# EAGLE design gprs_i2c (EAGLE 7.3.0)
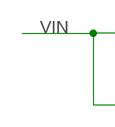
[diagram p0: schematic, sheet 1, part 1 of 2]
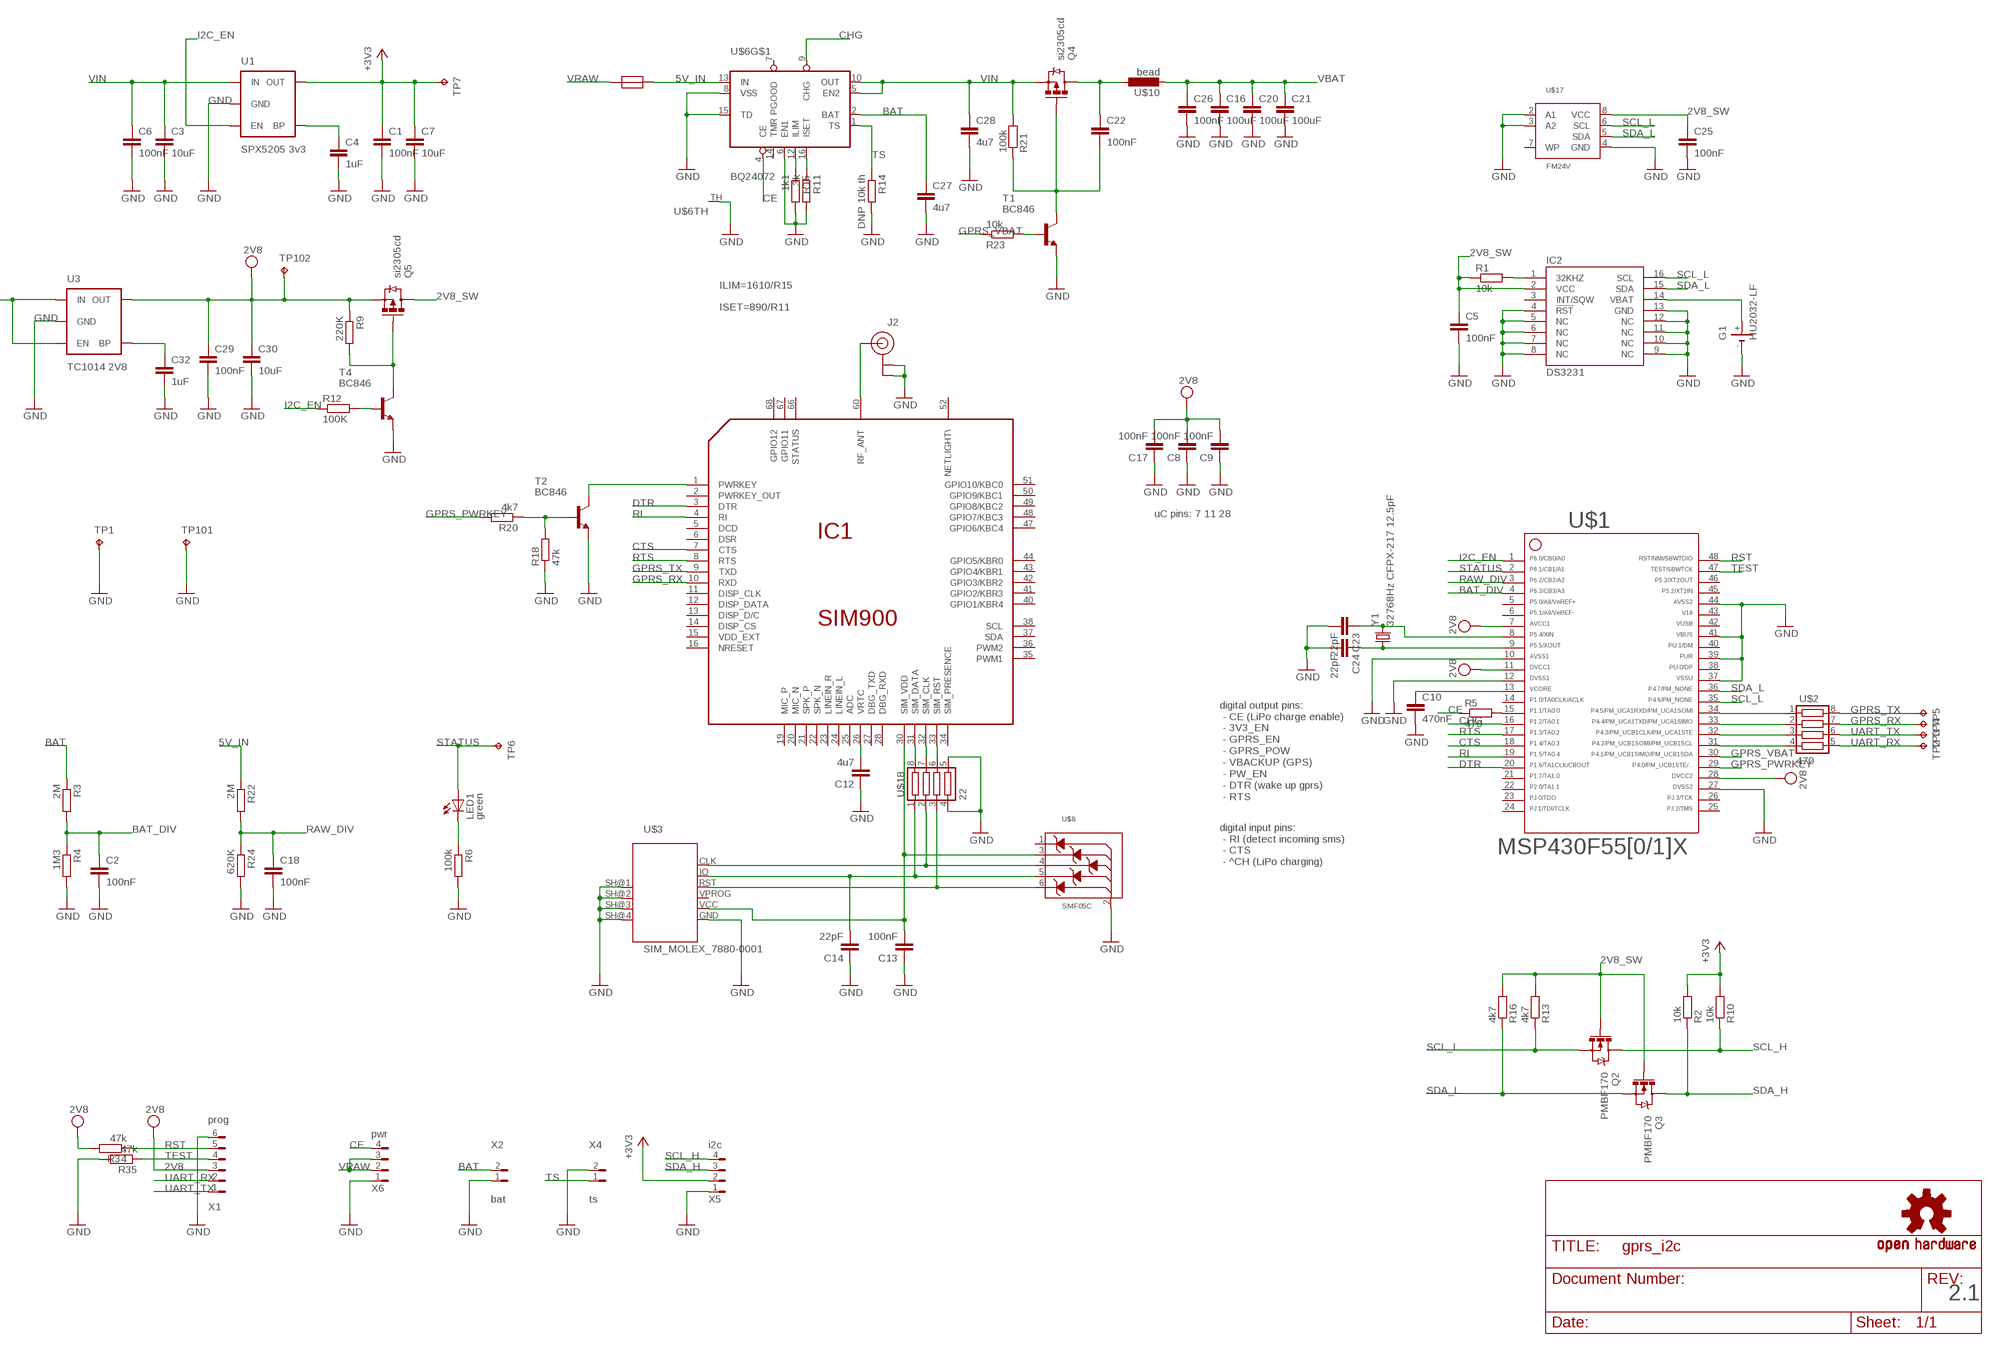
[diagram p1: schematic, sheet 1, part 2 of 2]

## Parts
C1  100nF  C-EUC0805  [C0805]
C2  100nF  C-EUC0805  [C0805]
C3  10uF  C-EUC0805  [C0805]
C4  1uF  C-EUC0805  [C0805]
C5  100nF  C-EUC0805  [C0805]
C6  100nF  C-EUC0805  [C0805]
C7  10uF  C-EUC1206  [C1206]
C8  100nF  C-EUC0805  [C0805]
C9  100nF  C-EUC0805  [C0805]
C10  470nF  C-EUC0805  [C0805]
C12  4u7  C-EUC0805  [C0805]
C13  100nF  C-EUC0805  [C0805]
C14  22pF  C-EUC0805  [C0805]
C16  100uF  C-EUC1206  [C1206]
C17  100nF  C-EUC0805  [C0805]
C18  100nF  C-EUC0805  [C0805]
C20  100uF  C-EUC1206  [C1206]
C21  100uF  C-EUC1206  [C1206]
C22  100nF  C-EUC0805  [C0805]
C23  22pF  C-EUC0805  [C0805]
C24  22pF  C-EUC0805  [C0805]
C25  100nF  C-EUC0805  [C0805]
C26  100nF  C-EUC0805  [C0805]
C27  4u7  C-EUC1206  [C1206]
C28  4u7  C-EUC1206  [C1206]
C29  100nF  C-EUC0805  [C0805]
C30  10uF  C-EUC1206  [C1206]
C32  1uF  C-EUC0805  [C0805]
G1  HU2032-LF  [HU2032-LF]
IC1  SIM900  [SIM900]
IC2  DS3231  [SO-16]
J2  U.FL  [U.FL]
LED1  green  LEDCHIPLED_0805  [CHIPLED_0805]
Q2  PMBF170  MOSFET-NCHANNEL_SOT23-3  [SOT23-3]
Q3  PMBF170  MOSFET-NCHANNEL_SOT23-3  [SOT23-3]
Q4  si2305cd  MOSFET-PCHANNELSMD_POWER  [SOT23-3_POWER@1]
Q5  si2305cd  MOSFET-PCHANNELSMD_POWER  [SOT23-3_POWER@1]
R1  10k  R-EU_R0805W  [R0805W]
R2  10k  R-EU_R0805W  [R0805W]
R3  2M  R-EU_R0805W  [R0805W]
R4  1M3  R-EU_R0805W  [R0805W]
R5  470  R-EU_R0805W  [R0805W]
R6  100k  R-EU_R0805W  [R0805W]
R9  220K  R-EU_R0805W  [R0805W]
R10  10k  R-EU_R0805W  [R0805W]
R11  3k  R-EU_R0805W  [R0805W]
R12  100K  R-EU_R0805W  [R0805W]
R13  4k7  R-EU_R0805W  [R0805W]
R14  DNP 10k th  R-EU_R0805W  [R0805W]
R15  1k1  R-EU_R0805W  [R0805W]
R16  4k7  R-EU_R0805W  [R0805W]
R18  47k  R-EU_R0805W  [R0805W]
R20  4k7  R-EU_R0805W  [R0805W]
R21  100k  R-EU_R0805W  [R0805W]
R22  2M  R-EU_R0805W  [R0805W]
R23  10k  R-EU_R0805W  [R0805W]
R24  620K  R-EU_R0805W  [R0805W]
R34  47k  R-EU_R0805W  [R0805W]
R35  47k  R-EU_R0805W  [R0805W]
T1  BC846  [SOT23]
T2  BC846  [SOT23]
T4  BC846  [SOT23]
TP1  TPTP12R  [TP12R]
TP2  TPTP12R  [TP12R]
TP3  TPTP12R  [TP12R]
TP4  TPTP12R  [TP12R]
TP5  TPTP12R  [TP12R]
TP6  TPTP12R  [TP12R]
TP7  TPTP12R  [TP12R]
TP101  TPTP12R  [TP12R]
TP102  TPTP12R  [TP12R]
U1  SPX5205 3v3  V_REG_LDOSMD  [SOT23-5]
U3  TC1014 2V8  V_REG_LDOSMD  [SOT23-5]
U$1  MSP430F5510  F55[0/1]X---PT48  [PT48]
U$2  470  RES_ARR  [YC164]
U$3  SIM_MOLEX_7880-0001  [MOLEX_7880-0001]
U$5  RESETTABLE_0805  [0805W]
U$6  BQ24072  [S-PVQFN-N16]
U$7  OSHW-LOGOM  [OSHW-LOGO-M]
U$8  SMF05C  [SC-88]
U$10  bead  INDUCTOR  [L0805W]
U$17  FM24V  [SO-08]
U$18  22  RES_ARR  [YC164]
X1  prog  MOLEX_6VERTICAL  [0530470610]
X2  bat  MOLEX_2HORIZONTAL  [0530480210]
X4  ts  MOLEX_2HORIZONTAL  [0530480210]
X5  i2c  MOLEX_4HORIZONTAL  [0530480401]
X6  pwr  MOLEX_4HORIZONTAL  [0530480401]
Y1  32768Hz CFPX-217 12.5pF  CRYSTAL3.2X1.5  [CRYSTAL-SMD-3.2X1.5]

## Nets
2V8: C8.2 C9.2 C17.2 C29.1 C30.1 Q5.2(S) R9.1 R34.2 TP102.TP U3.5(OUT) U$1.7 U$1.11 U$1.28 X1.3
2V8_SW: C5.1 C25.1 IC2.2(VCC) Q2.1(G) Q3.1(G) Q5.3(D) R1.1 R13.2 R16.2 U$17.8(VCC)
5V_IN: R22.1 U$5.2 U$6.13(IN)
+3V3: C1.1 C7.1 R2.2 R10.2 TP7.TP U1.5(OUT) X5.2
BAT: C27.1 R3.1 U$6.2(BAT) X2.2
BAT_DIV: C2.1 R3.2 R4.1 U$1.4
CE: R5.1 U$6.4(CE) X6.4
CHG: U$1.16 U$6.9(CHG)
CTS: IC1.7(CTS) U$1.18
DTR: IC1.3(DTR) U$1.20
GND: C1.2 C2.2 C3.2 C4.2 C5.2 C6.2 C7.2 C8.1 C9.1 C10.2 C12.1 C13.1 C14.1 C16.2 C17.1 C18.2 C20.2 C21.2 C23.2 C24.2 C25.2 C26.2 C27.2 C28.2 C29.2 C30.2 C32.2 G1.- IC2.4(!RST) IC2.5(NC) IC2.6(NC) IC2.7(NC) IC2.8(NC) IC2.9(NC) IC2.10(NC) IC2.11(NC) IC2.12(NC) IC2.13(GND) J2.P$1(GND) J2.P$2(GND) R4.2 R6.2 R11.2 R14.2 R15.2 R18.1 R24.2 R35.2 T1.2(E) T2.2(E) T4.2(E) TP1.TP TP101.TP U1.2(GND) U3.2(GND) U$1.10 U$1.12 U$1.27 U$1.37 U$1.39 U$1.41 U$1.44 U$3.GND U$3.SH@1(SH) U$3.SH@2(SH) U$3.SH@3(SH) U$3.SH@4(SH) U$6.6(EN1) U$6.8(VSS) U$6.15(TD) U$6.TH(TH:TH) U$8.2(ANODE) U$17.2(A1) U$17.3(A2) U$17.4(GND) U$18.4 U$18.5 X1.6 X2.1 X4.2 X5.1 X6.1
GPRS_PWRKEY: R20.2 U$1.29
GPRS_RX: IC1.10(RXD) TP4.TP U$2.7
GPRS_TX: IC1.9(TXD) TP5.TP U$2.8
GPRS_VBAT: R23.1 U$1.30
I2C_EN: R12.1 U1.3(EN) U$1.1
N$1: U$1.32 U$2.3
N$2: C4.1 U1.4(BP)
N$3: U$1.31 U$2.4
N$4: U$1.33 U$2.2
N$5: G1.+ IC2.14(VBAT)
N$6: C10.1 U$1.13
N$7: R23.2 T1.1(B)
N$8: LED1.C R6.1
N$9: IC2.1(32KHZ) R1.2
N$10: U$1.34 U$2.1
N$11: R5.2 U$1.15
N$14: Q5.1(G) R9.2 T4.3(C)
N$15: R12.2 T4.1(B)
N$17: IC1.31(SIM_DATA) U$18.8
N$18: IC1.32(SIM_CLK) U$18.7
N$19: IC1.33(SIM_RST) U$18.6
N$25: C24.1 U$1.9 Y1.P$1
N$26: C23.1 U$1.8 Y1.P$2
N$27: R11.1 U$6.16(ISET)
N$33: R15.1 U$6.12(ILIM)
N$45: R18.2 R20.1 T2.1(B)
N$46: IC1.60(RF_ANT) J2.P$3(SIGNAL)
N$48: C22.2 Q4.1(G) R21.1 T1.3(C)
N$49: C22.1 Q4.3(D) U$10.1
N$50: C32.1 U3.4(BP)
PWRKEY: IC1.1(PWRKEY) T2.3(C)
RAW_DIV: C18.1 R22.2 R24.1 U$1.3
RI: IC1.4(RI) U$1.19
RST: R34.1 U$1.48 X1.5
RTS: IC1.8(RTS) U$1.17
SCL_H: Q2.3(D) R10.1 X5.4
SCL_L: IC2.16(SCL) Q2.2(S) R13.1 U$1.35 U$17.6(SCL)
SDA_H: Q3.3(D) R2.1 X5.3
SDA_L: IC2.15(SDA) Q3.2(S) R16.1 U$1.36 U$17.5(SDA)
SIM_VCC: C13.2 IC1.30(SIM_VDD) U$3.VCC U$8.3(CATODE2)
SIMLOCK_CLK: U$3.CLK U$8.4(CATODE3) U$18.2
SIMLOCK_IO: C14.2 U$3.IO U$8.5(CATODE4) U$18.1
SIMLOCK_RST: U$3.RST U$8.6(CATODE5) U$18.3
STATUS: LED1.A TP6.TP U$1.2
TEST: R35.1 U$1.47 X1.4
TS: R14.1 U$6.1(TS) X4.1
UART_RX: TP2.TP U$2.5 X1.2
UART_TX: TP3.TP U$2.6 X1.1
VBAT: C16.1 C20.1 C21.1 C26.1 U$10.2
VIN: C3.1 C6.1 C28.1 Q4.2(S) R21.2 U1.1(IN) U3.1(IN) U3.3(EN) U$6.5(EN2) U$6.10(OUT)
VRAW: U$5.1 X6.2 X6.3
VRTC: C12.2 IC1.26(VRTC)
Unconnected: G1.+@1(+) IC1.2(PWRKEY_OUT) IC1.5(DCD) IC1.6(DSR) IC1.11(DISP_CLK) IC1.12(DISP_DATA) IC1.13(DISP_D/C) IC1.14(DISP_CS) IC1.15(VDD_EXT) IC1.16(NRESET) IC1.19(MIC_P) IC1.20(MIC_N) IC1.21(SPK_P) IC1.22(SPK_N) IC1.23(LINEIN_R) IC1.24(LINEIN_L) IC1.25(ADC) IC1.27(DBG_TXD) IC1.28(DBG_RXD) IC1.34(SIM_PRESENCE) IC1.35(PWM1) IC1.36(PWM2) IC1.37(SDA) IC1.38(SCL) IC1.40(GPIO1/KBR4) IC1.41(GPIO2/KBR3) IC1.42(GPIO3/KBR2) IC1.43(GPIO4/KBR1) IC1.44(GPIO5/KBR0) IC1.47(GPIO6/KBC4) IC1.48(GPIO7/KBC3) IC1.49(GPIO8/KBC2) IC1.50(GPIO9/KBC1) IC1.51(GPIO10/KBC0) IC1.52(NETLIGHT\) IC1.66(STATUS) IC1.67(GPIO11) IC1.68(GPIO12) IC2.3(INT/SQW) U$1.5 U$1.6 U$1.14 U$1.21 U$1.22 U$1.23 U$1.24 U$1.25 U$1.26 U$1.38 U$1.40 U$1.45 U$3.VPROG U$6.7(PGOOD) U$6.14(TMR) U$8.1(CATODE1) U$17.7(WP)

## Notes on the sheet
- ILIM=1610/R15
- ISET=890/R11
- uC pins: 7 11 28
- digital output pins: 
   - CE (LiPo charge enable)
   - 3V3_EN
   - GPRS_EN
   - GPRS_POW
   - VBACKUP (GPS)
   - PW_EN
   - DTR (wake up gprs)
   - RTS
- digital input pins:
   - RI (detect incoming sms)
   - CTS
   - ^CH (LiPo charging)
- 2.1

## Power pins joined to a net without a drawn wire
42: U$1.42
43: U$1.43
46: U$1.46
GND: IC1.17(GND) IC1.18(GND) IC1.29(GND) IC1.39(GND) IC1.45(GND) IC1.46(GND) IC1.53(GND) IC1.54(GND) IC1.58(GND) IC1.59(GND) IC1.61(GND) IC1.62(GND) IC1.63(GND) IC1.64(GND) IC1.65(GND)
VBAT: IC1.55(VBAT) IC1.56(VBAT) IC1.57(VBAT)

## Library data of the parts
C1-C10 C12-C14 C16-C18 C20-C30 C32 = rcl:C-EU: CAPACITOR, European symbol
G1 = Simplex-Battery:HU2032-LF: Renata HU2032 Li battery holder
IC1 = Simplex-ICs:SIM900: SIM900
IC2 = Simplex-ICs:DS3231: DS3231 RTC
J2 = SparkFun-Connectors:U.FL: SMD antenna connector- WRL-09144
LED1 = led:LED: LED OSRAM: - CHIPLED LG R971, LG N971, LY N971, LG Q971, LY Q971, LO R971, LY R971 LH N974, LH R974 LS Q976, LO Q976, LY Q976 LO Q996 - Hyper CHIPLED LW Q18S LB Q993, LB Q99A, LB R99A - SideLED LS A670, LO A670, LY A670, LG A670, LP A670 LB A673, LV A673, LT A673, LW A673 LH A674 LY A675 LS A676, LA A676, LO A676, LY A676, LW A676 LS A679, LY A679, LG A679 - Hyper Micro SIDELED® LS Y876, LA Y876, LO Y876, LY Y876 LT Y87S - SmartLED LW L88C, LW L88S LB L89C, LB L89S, LG L890 LS L89K, LO L89K, LY L89K LS L896, LA L896, LO L896, LY L896 - TOPLED LS T670, LO T670, LY T670, LG T670, LP T670 LSG T670, LSP T670, LSY T670, LOP T670, LYG T670 LG T671, LOG T671, LSG T671 LB T673, LV T673, LT T673, LW T673 LH T674 LS T676, LA T676, LO T676, LY T676, LB T676, LH T676, LSB T676, LW T676 LB T67C, LV T67C, LT T67C, LS T67K, LO T67K, LY T67K, LW E67C LS E67B, LA E67B, LO E67B, LY E67B, LB E67C, LV E67C, LT E67C LW T67C LS T679, LY T679, LG T679 LS T770, LO T770, LY T770, LG T770, LP T770 LB T773, LV T773, LT T773, LW T773 LH T774 LS E675, LA E675, LY E675, LS T675 LS T776, LA T776, LO T776, LY T776, LB T776 LHGB T686 LT T68C, LB T68C - Hyper Mini TOPLED® LB M676 - Mini TOPLED Santana® LG M470 LS M47K, LO M47K, LY M47K Source: http://www.osram.convergy.de LUXEON: - LUMILED® LXK2-PW12-R00, LXK2-PW12-S00, LXK2-PW14-U00, LXK2-PW14-V00 LXK2-PM12-R00, LXK2-PM12-S00, LXK2-PM14-U00 LXK2-PE12-Q00, LXK2-PE12-R00, LXK2-PE12-S00, LXK2-PE14-T00, LXK2-PE14-U00 LXK2-PB12-K00, LXK2-PB12-L00, LXK2-PB12-M00, LXK2-PB14-N00, LXK2-PB14-P00, LXK2-PB14-Q00 LXK2-PR12-L00, LXK2-PR12-M00, LXK2-PR14-Q00, LXK2-PR14-R00 LXK2-PD12-Q00, LXK2-PD12-R00, LXK2-PD12-S00 LXK2-PH12-R00, LXK2-PH12-S00 LXK2-PL12-P00, LXK2-PL12-Q00, LXK2-PL12-R00 Source: www.luxeon.com KINGBRIGHT: KA-3528ASYC Source: www.kingbright.com
Q2 Q3 = Simplex-DiscreteSemi:MOSFET-NCHANNEL: Generic N-channel mosfet
Q4 Q5 = Simplex-DiscreteSemi:MOSFET-PCHANNEL: Generic PMOSFET
R1-R6 R9-R16 R18 R20-R24 R34 R35 = rcl:R-EU_: RESISTOR, European symbol
T1 T2 T4 = transistor:BC846: NPN TRANSISTOR
TP1-TP7 TP101 TP102 = testpad:TP: Test pad
U1 U3 = SparkFun:V_REG_LDO: Voltage Regulator LDO Standard 150mA LDO voltage regulator in SOT-23 layout. Micrel part MIC5205. BP (by-pass) pin is used to lower output noise with 470pF cap.
U$1 = TI_MSP430_v16:F55[0/1]X---PT48: ***F55[0/1/2]X*** PT48 Rev. 1.0 06/2010 "http://www.ti.com/lit/gpn/msp430f5509" Only for FF5504, F5508,F5509,F5510
U$2 U$18 = Simplex-rlc:RES_ARR: resistor chip array yageo YC164 series (8pin/4R)
U$3 = Simplex-Connectors:SIM: SIM card holders without lock detection
U$5 = Simplex-Fuses:RESETTABLE: resettable fuse
U$6 = Simplex-ICs:BQ24072: TI BQ24072 - Li battery charger and power path management ic
U$7 = SparkFun:OSHW-LOGO: Open Source Hardware Logo This logo indicates the piece of hardware it is found on incorporates a OSHW license and/or adheres to the definition of open source hardware found here: http://freedomdefined.org/OSHW
U$8 = Simplex-DiscreteSemi:SMF05C: ON Semiconductor SMF05C 5-line transient voltage suppressor array
U$10 = Simplex-rlc:INDUCTOR: smd inductors
U$17 = Simplex-ICs:FM24V: CYPRESS FM24Vxx serial f-ram
X1 = Simplex-Connectors:MOLEX_6: Molex 6 pin connectors 1.25mm PicoBlade
X2 X4 = Simplex-Connectors:MOLEX_2: Molex 2 pin connectors 1.25mm PicoBlade
X5 X6 = Simplex-Connectors:MOLEX_4: Molex 4 pin connectors 1.25mm PicoBlade
Y1 = Simplex-FreqCtrl:CRYSTAL: smd crystals

## Net classes
1 vcc: width 0.203 mm

## Board
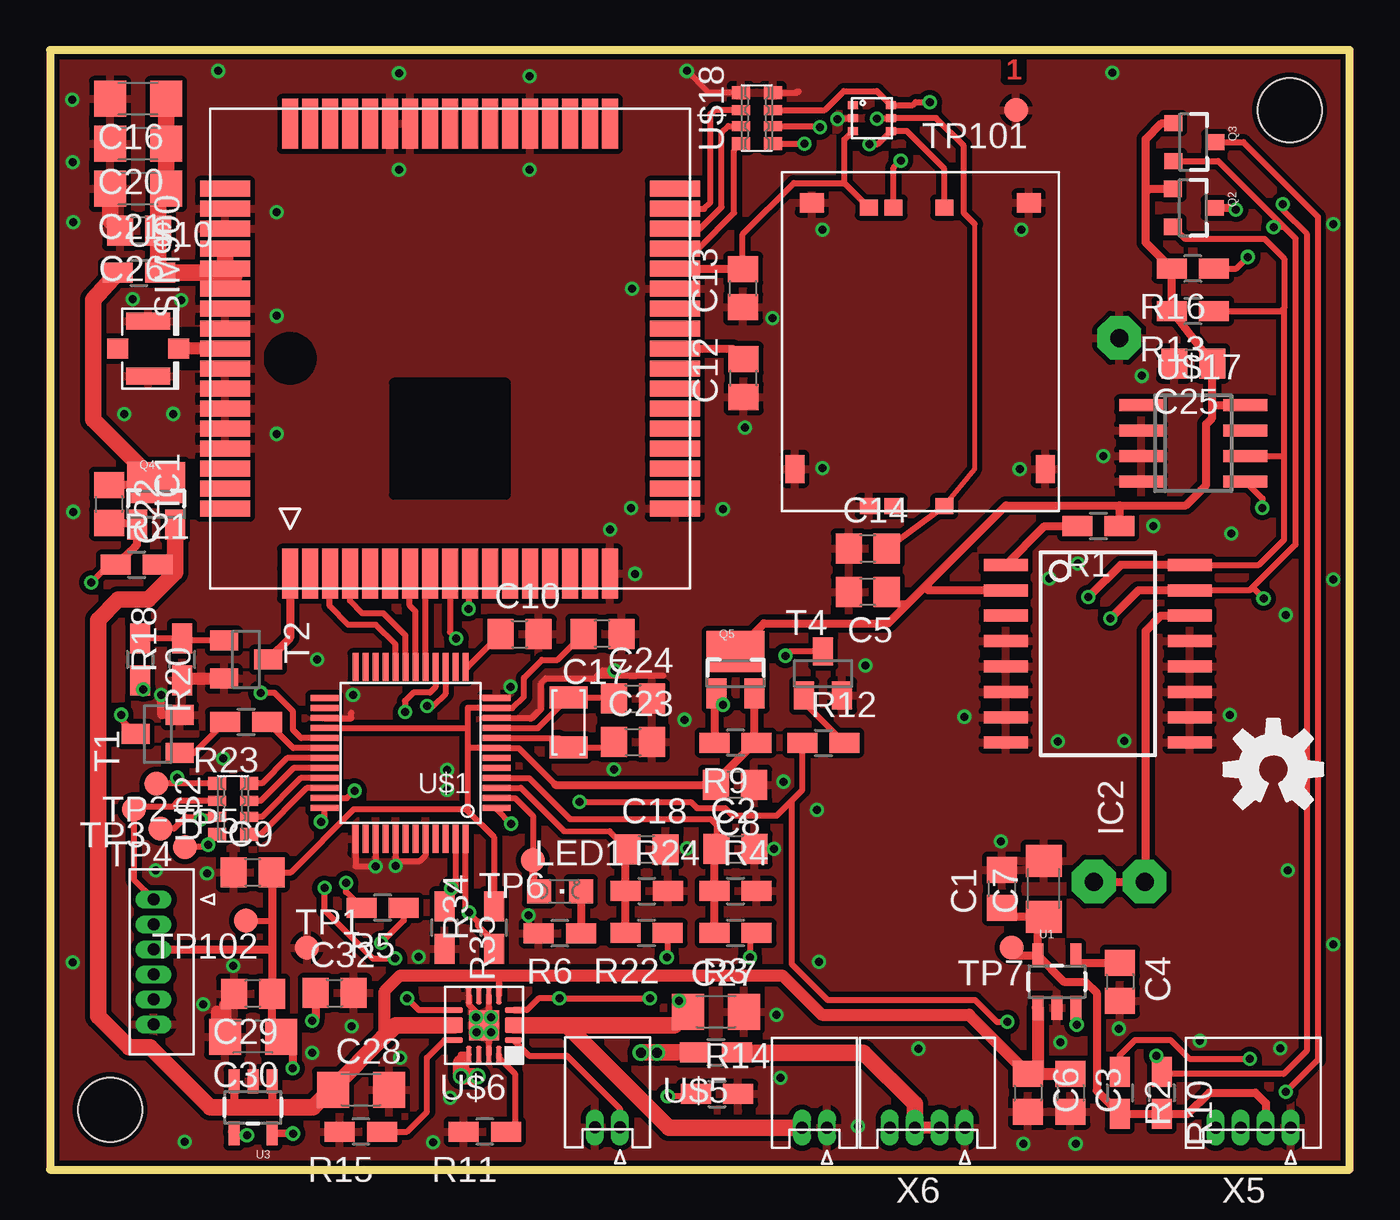
[diagram p2: board, top side]
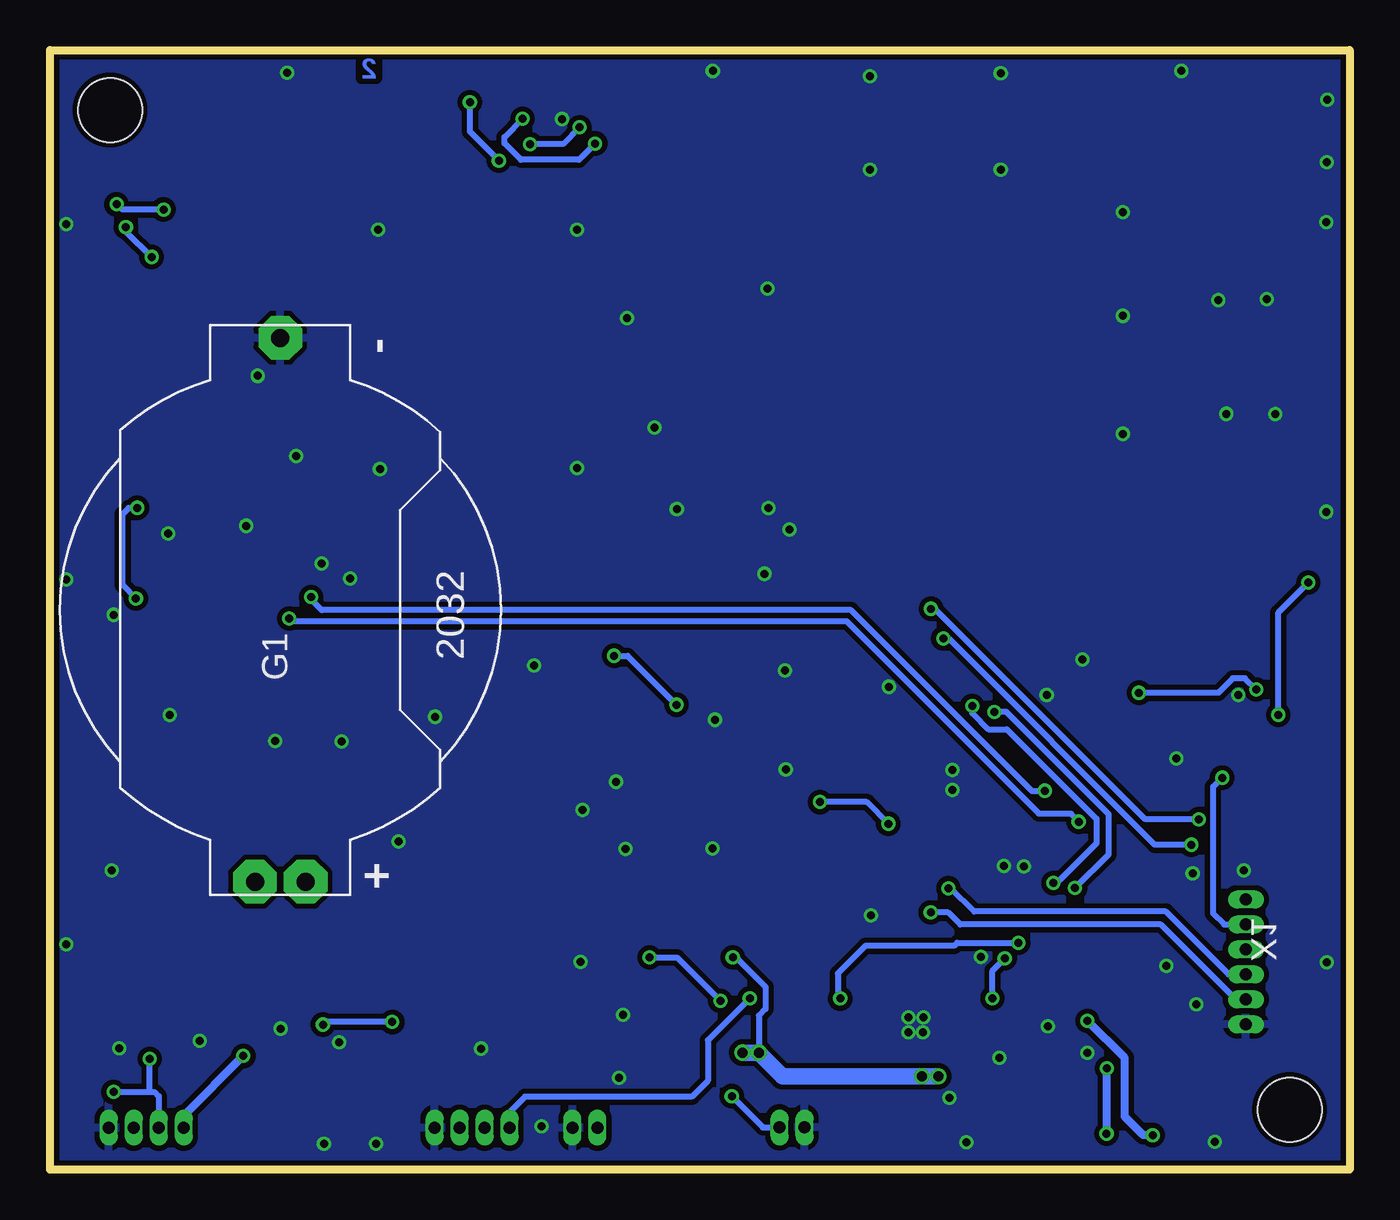
[diagram p3: board, bottom side, seen from below]

Size 65 x 56 mm. Coordinates in mm from the lower left corner, seen from the top.
Outline: 0,0 65,0 65,56 0,56 0,0
Copper layers (1*2*15*16): Top 0.035mm / dielectric 0.2mm / Route2 0.0175mm / dielectric 1.1mm / Route15 0.0175mm / dielectric 0.2mm / Bottom 0.035mm
Design rules "SeeedStudio_DRU_no_angle_20130527": minimum track width 6mil, minimum drill 12mil, track to track 6mil, track to pad 6mil, pad to pad 6mil, via to via 6mil, smd to smd 0mil, copper to edge 10mil, drill to drill 10mil, minimum pad ring 6mil, minimum via ring 6mil, stop-mask expansion 2mil, vias tented up to drill 25mil, thermal gap 10mil
Holes 3.2 mm at 62,53 3,3
tRestrict: 1 lines

### Footprints (pad centres in the part's own frame; a part is rotated, then mirrored left to right if it is on the bottom)
C0805 = smd 1.3 x 1.5: 1 -0.95,0; 2 0.95,0
C1206 = smd 1.6 x 1.8: 1 -1.4,0; 2 1.4,0
HU2032-LF = drill 0.9 pad 2.184 octagon: + -13.6,-1.27; +@1 -13.6,1.27; - 13.6,0
SIM900 = smd 2.5 x 0.8: 1 -11.25,8; 2 -11.25,7; 3 -11.25,6; 4 -11.25,5; 5 -11.25,4; 6 -11.25,3; 7 -11.25,2; 8 -11.25,1; 9 -11.25,0; 10 -11.25,-1; 11 -11.25,-2; 12 -11.25,-3; 13 -11.25,-4; 14 -11.25,-5; 15 -11.25,-6; 16 -11.25,-7; 17 -11.25,-8; 35 11.25,-8; 36 11.25,-7; 37 11.25,-6; 38 11.25,-5; 39 11.25,-4; 40 11.25,-3; 41 11.25,-2; 42 11.25,-1; 43 11.25,0; 44 11.25,1; 45 11.25,2; 46 11.25,3; 47 11.25,4; 48 11.25,5; 49 11.25,6; 50 11.25,7; 51 11.25,8 | smd 0.8 x 2.5: 18 -8,-11.25; 19 -7,-11.25; 20 -6,-11.25; 21 -5,-11.25; 22 -4,-11.25; 23 -3,-11.25; 24 -2,-11.25; 25 -1,-11.25; 26 0,-11.25; 27 1,-11.25; 28 2,-11.25; 29 3,-11.25; 30 4,-11.25; 31 5,-11.25; 32 6,-11.25; 33 7,-11.25; 34 8,-11.25; 52 8,11.25; 53 7,11.25; 54 6,11.25; 55 5,11.25; 56 4,11.25; 57 3,11.25; 58 2,11.25; 59 1,11.25; 60 0,11.25; 61 -1,11.25; 62 -2,11.25; 63 -3,11.25; 64 -4,11.25; 65 -5,11.25; 66 -6,11.25; 67 -7,11.25; 68 -8,11.25
SO-16 = smd 0.6 x 2.2: 1 -4.445,-4.6; 2 -3.175,-4.6; 3 -1.905,-4.6; 4 -0.635,-4.6; 5 0.635,-4.6; 6 1.905,-4.6; 7 3.175,-4.6; 8 4.445,-4.6; 9 4.445,4.6; 10 3.175,4.6; 11 1.905,4.6; 12 0.635,4.6; 13 -0.635,4.6; 14 -1.905,4.6; 15 -3.175,4.6; 16 -4.445,4.6
U.FL = smd 2.2 x 0.85: P$1 0,1.375; P$2 0,-1.375 | smd 1.05 x 1: P$3 1.525,0; P$4 -1.525,0
CHIPLED_0805 = smd 1.2 x 1.2: A 0,-1.05; C 0,1.05
SOT23-3 = smd 0.8 x 0.9: 1 -0.95,-1; 2 0.95,-1; 3 0,1.1
SOT23-3_POWER@1 = smd 1 x 1.5: 1 -0.939,-1.384; 2 0.961,-1.384 | smd 2.9 x 2.05: 3 0.011,0.716
R0805W = smd 1.5 x 1: 1 -1.052,0; 2 1.052,0
SOT23 = smd 1 x 1.4: 1 -0.95,-1.1; 2 0.95,-1.1; 3 0,1.1
TP12R = smd 1.2 x 1.2: TP 0,0
SOT23-5 = smd 0.55 x 1.2: 1 -0.95,-1.3; 2 0,-1.3; 3 0.95,-1.3; 4 0.95,1.3; 5 -0.95,1.3
PT48 = smd 1.4 x 0.3: 1 -4.3,2.75; 2 -4.3,2.25; 3 -4.3,1.75; 4 -4.3,1.25; 5 -4.3,0.75; 6 -4.3,0.25; 7 -4.3,-0.25; 8 -4.3,-0.75; 9 -4.3,-1.25; 10 -4.3,-1.75; 11 -4.3,-2.25; 12 -4.3,-2.75; 25 4.3,-2.75; 26 4.3,-2.25; 27 4.3,-1.75; 28 4.3,-1.25; 29 4.3,-0.75; 30 4.3,-0.25; 31 4.3,0.25; 32 4.3,0.75; 33 4.3,1.25; 34 4.3,1.75; 35 4.3,2.25; 36 4.3,2.75 | smd 0.3 x 1.4: 13 -2.75,-4.3; 14 -2.25,-4.3; 15 -1.75,-4.3; 16 -1.25,-4.3; 17 -0.75,-4.3; 18 -0.25,-4.3; 19 0.25,-4.3; 20 0.75,-4.3; 21 1.25,-4.3; 22 1.75,-4.3; 23 2.25,-4.3; 24 2.75,-4.3; 37 2.75,4.3; 38 2.25,4.3; 39 1.75,4.3; 40 1.25,4.3; 41 0.75,4.3; 42 0.25,4.3; 43 -0.25,4.3; 44 -0.75,4.3; 45 -1.25,4.3; 46 -1.75,4.3; 47 -2.25,4.3; 48 -2.75,4.3
YC164 = smd 0.65 x 0.9: 1 -1.275,-0.8; 4 1.275,-0.8; 5 1.275,0.8; 8 -1.275,0.8 | smd 0.5 x 0.9: 2 -0.4,-0.8; 3 0.4,-0.8; 6 0.4,0.8; 7 -0.4,0.8
MOLEX_7880-0001 = smd 0.8 x 0.9: CLK 1.77,8.13; GND 16.71,4.35; IO 16.71,8.13; RST 1.77,5.59; VCC 1.77,4.35; VPROG 16.71,5.59 | smd 0.95 x 1.2: SH@1 1.54,1.5; SH@4 1.54,12.35 | smd 1.4 x 0.95: SH@2 14.85,0.66; SH@3 14.85,13.18
0805W = smd 1.5 x 1: 1 -1.052,0; 2 1.052,0
S-PVQFN-N16 = smd 0.85 x 0.28: 1 -0.725,2.225; 4 -0.725,0.725; 9 2.225,0.725; 12 2.225,2.225 | smd 0.85 x 0.78: 2 -0.725,1.475; 10 2.225,1.475 | smd 0.28 x 0.85: 5 0,0; 6 0.5,0; 7 1,0; 8 1.5,0; 13 1.5,2.95; 14 1,2.95; 15 0.5,2.95; 16 0,2.95 | smd 1.5 x 1.5: TH 0.75,1.475
SC-88 = smd 0.5 x 0.4: 1 0,1.3; 2 0,0.65; 3 0,0; 4 1.9,0; 5 1.9,0.65; 6 1.9,1.3
L0805W = smd 1.5 x 1: 1 -1.052,0; 2 1.052,0
SO-08 = smd 0.6 x 2.2: 1 -1.905,-2.6; 2 -0.635,-2.6; 3 0.635,-2.6; 4 1.905,-2.6; 5 1.905,2.6; 6 0.635,2.6; 7 -0.635,2.6; 8 -1.905,2.6
0530470610 = drill 0.6 pad 0.813 long: 1 0,0; 2 1.25,0; 3 2.5,0; 4 3.75,0; 5 5,0; 6 6.25,0
0530480210 = drill 0.6 pad 0.9 long: 1 0,0; 2 1.25,0
0530480401 = drill 0.6 pad 0.9 long: 1 0,0; 2 1.25,0; 3 2.5,0; 4 3.75,0
CRYSTAL-SMD-3.2X1.5 = smd 1.1 x 1.9: P$1 -1.25,0; P$2 1.25,0

### Placement (x,y rotation side)
C1  47.62,14.05 90 top
C2  34.29,16.03 0 top
C3  51.04,3.84 270 top
C4  53.52,9.4 270 top
C5  40.9,28.89 180 top
C6  48.92,3.84 270 top
C7  49.7,14.05 90 top
C8  34.27,19.24 180 top
C9  10.14,14.87 0 top
C10  23.49,26.78 0 top
C12  34.69,39.58 90 top
C13  34.67,44.08 90 top
C14  40.9,31.07 0 top
C16  4.4,53.56 180 top
C17  27.63,26.8 180 top
C18  29.84,16.02 0 top
C20  4.4,51.31 180 top
C21  4.4,49.06 180 top
C22  2.95,33.29 270 top
C23  29.16,21.39 0 top
C24  29.16,23.56 0 top
C25  57.18,40.32 180 top
C26  4.45,46.96 180 top
C27  33.31,7.9 0 top
C28  15.55,4 0 top
C29  10.15,8.8 180 top
C30  10.15,6.64 180 top
C32  14.24,8.83 0 top
G1  53.48,28 90 bottom
IC1  20,41.06 90 top
IC2  52.41,25.8 270 top
J2  4.91,41.07 0 top
LED1  25.5,13.92 270 top
Q2  57.16,48.1 270 top
Q3  57.18,51.39 270 top
Q4  5.29,33.65 0 top
Q5  34.28,25.19 0 top
R1  52.43,32.18 180 top
R2  53.51,3.84 270 top
R3  34.29,11.83 180 top
R4  34.29,13.93 0 top
R5  16.64,13.1 180 top
R6  25.5,11.82 180 top
R9  34.29,21.35 180 top
R10  55.6,3.83 270 top
R11  21.75,1.9 180 top
R12  38.68,21.34 0 top
R13  57.16,42.94 180 top
R14  33.37,3.78 0 top
R15  15.55,1.9 180 top
R16  57.16,45.07 180 top
R18  6.61,25.51 90 top
R20  4.51,25.51 270 top
R21  4.34,30.26 0 top
R22  29.84,11.83 180 top
R23  9.81,22.38 180 top
R24  29.85,13.93 0 top
R34  22.2,12.1 90 top
R35  19.73,12.1 270 top
T1  5.39,21.78 90 top
T2  9.81,25.51 270 top
T4  38.67,24.81 0 top
TP1  12.85,11.09 0 top
TP2  5.32,19.3 180 top
TP3  4.19,18.02 180 top
TP4  5.52,17.06 180 top
TP5  6.75,16.13 0 top
TP6  24.15,15.48 180 top
TP7  48.11,11.11 180 top
TP101  48.32,52.99 180 top
TP102  9.8,12.45 180 top
U1  50.36,9.4 0 top
U3  10.15,3.11 180 top
U$1  18.03,20.83 180 top
U$2  9.16,18.04 90 top
U$3  36.6,49.89 270 top
U$5  33.31,5.86 180 top
U$6  22.45,8.7 180 top
U$7  61.19,20.02 0 top
U$8  40.15,51.94 0 top
U$10  4.45,44.86 0 top
U$17  57.18,36.33 270 top
U$18  35.35,52.59 90 top
X1  5.18,13.51 270 top
X2  38.87,2.09 180 top
X4  28.51,2.11 180 top
X5  62.06,2.09 180 top
X6  45.76,2.09 180 top
Y1  25.93,22.36 270 top

### Tracks (layer width: path | path; a pad name or v marks a point on that pad's centre or on a via)
2V8  (via drill 0.4)
  Top 0.305: U$1.28 20.89,22.08 | C17.2 25.38,25.5 24.6,25.5 23.7,24.6 23.7,23.65 23.13,23.08 U$1.11 22.31,23.1 20.89,23.1 20.89,22.08 | TP102.TP 11.07,12.45 11.1,12.42 | 20.89,21.08 20.89,17.95 | 20.89,17.95 22.21,16.63 R34.2 | 20.89,22.08 20.89,21.08 | 20.89,21.08 U$1.7 23.44,21.08 25.28,19.24 | C9.2 12.05,14.87 15.21,18.03 20.81,18.03 20.89,17.95 | 33.34,18.83 33.34,18.88 | 34.94,21.03 arc-19 R9.1
  Top 0.406: 11.1,6.95 C29.1 11.1,11.01 | v12.15,1.8 U3.5 | C30.1 12.14,6.64 v12.14,5.06 | X1.3 11.1,11.01 | C9.2 11.1,12.42 11.1,11.01 | C8.2 33.34,18.83 | 25.28,19.24 C8.2 | 35.34,23.81 Q5.2 35.24,21.35 R9.1 | C8.2 33.32,19.41 34.94,21.03
  Top 0.61: C30.1 11.1,6.95
  Bottom 0.305: v12.15,1.8 v12.14,1.8
  Bottom 0.406: v12.14,1.8 v12.14,5.06
2V8_SW
  Top 0.406: Q5.3 35.7,27.32 41.92,27.32 42.9,28.3 | 42.9,28.3 43.94,29.34 | 43.94,29.34 47.82,33.22 53.5,33.22 | 53.5,33.22 56.81,33.22 57.83,34.24 57.83,37.29 58.13,37.59 58.13,38.21 | C5.1 42.45,28.3 42.9,28.3 | R1.1 53.5,32.2 53.5,33.22 | IC2.2 43.94,28.98 43.94,29.34 | 58.13,38.21 C25.1 R13.2 R16.2 54.81,46.37 54.81,48.9 | U$17.8 59.76,38.21 58.13,38.21 | 54.81,48.9 54.81,51.55 55.59,52.33 Q3.1 | Q2.1 54.96,49.05 54.81,48.9
5V_IN  (via drill 0.4, 0.5)
  Top 0.305: U$6.13 20.55,5.75 20.55,5.35 | R22.1 30.89,10.65 v30.85,10.61
  Top 0.813: v21.38,4.66 v20.56,4.66 v20.55,4.66 20.55,5.35 | U$5.2 v29.55,5.86 v29.55,5.85
  Bottom 0.305: v30.85,10.61 30.69,10.61 29.21,9.13 29.21,8.03 29.55,7.69 v29.55,5.85
  Bottom 0.813: v30.36,5.85 v30.37,5.85 v29.55,5.85 28.36,4.66 v20.56,4.66
+3V3
  Top 0.406: U1.5 50.71,9.4 51.79,9.4 52.35,8.84 52.35,3.95 R2.2 R10.2 56.91,2.78 57.98,3.85 60.29,3.85 60.82,3.32 X5.2 | U1.5 49.41,12.76 49.5,12.76 C7.1 47.62,12.65 C1.1 | TP7.TP 48.11,10.7 U1.5
BAT  (via drill 0.4)
  Top 0.305: R3.1 35.01,11.5 v35.01,10.61 | v31.47,8.44 31.91,8 C27.1
  Top 0.813: U$6.2 25.82,7.22 | X2.2 30.95,2.1 25.82,7.22 | C27.1 31.23,7.22 25.82,7.22
  Bottom 0.305: v35.01,10.61 33.64,10.61 v31.47,8.44
BAT_DIV
  Top 0.305: C2.1 33.34,17.23 33.04,17.53 26,17.53 23.95,19.58 U$1.4
  Top 0.406: R3.2 R4.1 33.24,15.93 C2.1
CE  (via drill 0.4)
  Top 0.305: 23.62,7.97 U$6.4 23.85,7.98 24.43,8.55 v25.48,8.55 v30,8.56 | R5.1 17.69,12.46 v16.57,11.34
  Bottom 0.305: v25.48,8.55 25.59,8.55 25.59,9.81 24.21,11.19 19.77,11.19 19.62,11.34 v16.57,11.34 | v30,8.56 32.09,6.47 32.09,4.44 32.89,3.64 41.24,3.64 42.01,2.87 X6.4
CHG  (via drill 0.4)
  Top 0.305: U$6.9 18.45,7.97 v17.86,8.57 | U$1.16 19.28,24.13 19.01,23.86 18.18,23.86 17.76,23.44 v17.76,22.89 v17.77,22.89 | v17.25,10.56 16.14,10.56 13.73,12.97 v13.73,14.08
  Bottom 0.305: v17.86,8.57 17.86,9.95 v17.25,10.56 | v17.76,22.89 17.17,22.89 12.06,17.78 12.06,15.75 v13.73,14.08
CTS
  Top 0.305: U$1.18 18.28,27.92 17.99,28.21 IC1.7
DTR
  Top 0.305: U$1.20 17.28,26.28 16.31,27.25 14.92,27.25 13.99,28.18 IC1.3
GND  (via drill 0.4)
  Top 0.305: U$6.15 21.95,6.97 U$6.TH 21.7,7.74 | U$6.8 20.95,8.24 21.45,7.74 21.7,7.74 | U$6.6 21.95,7.74 21.7,7.74 | U$1.27 15.07,22.57 15.07,22.86 | U$1.10 24.09,22.58 | 24.09,22.58 24.42,22.91 | 23.98,22.57 24.1,22.57 | 24.1,22.57 24.57,23.04 24.57,24.33 24.81,24.57 27.25,24.57 27.39,24.71 | 27.39,24.71 30.67,24.71 | 27.39,24.71 27.65,24.97 v28.24,24.97 | U$1.41 v17.28,15.18 17.52,15.42 18.48,15.42 18.78,15.72 U$1.44 | U$1.39 v16.28,15.18 v16.29,15.17 15.28,15.17 U$1.37 | v23.94,12.71 23.94,12.33 R6.2 | v39.39,52.55 39.43,52.59 U$8.2 | 24.1,22.57 24.09,22.58 | U$18.5 32.94,53.87 v31.85,54.95 | U$18.4 37.38,53.87 37.44,53.92 37.38,53.92
  Top 0.406: T1.2 5.57,22.73 v5.57,23.74
  Top 0.61: C29.2 8.75,8.22 C30.2 arc-90 8.36,7.03 8.36,7.91 | R18.1 6.71,24.56 T2.2
  Top 0.813: C21.2 3,47.46 C26.2
  other vias: 1.14,10.36 9.17,10.19 7.67,8.26 64.18,47.29 1.17,47.39 21.32,7.62 22.07,7.61 21.33,6.87 22.07,6.87 17.52,5.59 1.11,53.51 3.72,37.79 6.73,1.38 13.11,5.84 11.34,36.8 11.34,47.88 11.34,42.7 15.15,23.73 18.43,10.63 28.2,20.01 31.86,16.07 8.66,20.57 7.85,14.81 36.34,7.73 50.53,6.37 36.69,19.4 36.21,16.04 19.87,18.99 19.87,19.98 53.14,54.86 53.47,7.05 38.47,10.38 38.36,17.99 40.79,25.22 51.42,30.32 50.42,21.42 53.74,21.44 61.81,27.75 59.01,22.73 45.73,22.65 61.92,14.96 61.54,6.06 57.52,6.44 64.19,11.27 64.19,29.51 8.41,54.95 17.45,54.84 17.45,50.02 23.98,50.02 23.98,54.68 29.12,44.06 29.07,33.09 33.65,33.04 6.16,37.8 4.13,43.53 6.56,43.48 1.17,32.9 19.16,1.36 23.03,24.15 13.36,25.51 28.01,32.02 29.27,29.8 38.63,35.08 48.5,35.04 48.58,47.01 38.64,47.01 34.77,37.11 36.14,42.59 52.68,35.69 43.44,6.05 36.53,4.58 40.41,2.17 51.3,1.29 47.57,16.41 15.09,7.16 5.29,14.96 1.14,50.38 49.99,29.56 59.08,31.81 31.74,22.5 55.18,32.2 48.69,1.28 20.02,3.58 54.62,39.7
  pour Top (isolate 0.254): 0,56 65,56 65,0 0,0
  pour Bottom (isolate 0.254): 0,56 65,56 65,0 0,0
GPRS_PWRKEY  (via drill 0.4)
  Top 0.305: R20.2 4.51,24.17 v4.67,24.01 | U$1.29 12.57,21.58 12.16,21.99 12.16,22.92 11.23,23.85 v10.53,23.85
  Bottom 0.305: v4.67,24.01 5.23,24.57 5.84,24.57 6.56,23.85 v10.53,23.85
GPRS_RX  (via drill 0.4)
  Top 0.305: U$2.7 7.42,17.64 | TP4.TP 6.21,17.06 6.79,17.64 7.42,17.64 | IC1.10 20.93,29.74 v20.93,28.05 | 7.42,17.64 v7.54,17.52
  Bottom 0.305: v7.54,17.52 10.21,17.52 20.74,28.05 v20.93,28.05
GPRS_TX  (via drill 0.4)
  Top 0.305: U$2.8 7.94,16.34 7.92,16.32 | 7.92,16.32 7.72,16.13 TP5.TP | IC1.9 20,26.88 v20.32,26.56 | v7.92,16.25 7.92,16.32
  Bottom 0.305: v7.92,16.25 9.74,16.25 20.05,26.56 v20.32,26.56
GPRS_VBAT
  Top 0.305: U$1.30 12.16,21.08 R23.1
I2C_EN  (via drill 0.4)
  Top 0.305: U$1.1 22.33,18.04 v23.07,17.3 | v26.49,18.38 32.06,18.38 32.36,18.08 33.77,18.08 34.14,17.71 36.36,17.71 37.09,18.44 | R12.1 37.63,18.98 37.09,18.44 | 37.09,18.44 37.09,10.28 38.89,8.48 46.27,8.48 47.37,7.38 v47.88,7.38 | U1.3 51.31,7.29 v51.35,7.25
  Bottom 0.305: v23.07,17.3 24.15,18.38 v26.49,18.38 | v47.88,7.38 51.22,7.38 v51.35,7.25
N$1
  Top 0.305: U$1.32 12.18,20.08 10.54,18.44 U$2.3
N$2
  Top 0.406: U1.4 51.31,10.35 C4.1
N$3
  Top 0.305: U$1.31 11.87,20.58 10.61,19.32 U$2.4
N$4
  Top 0.305: U$1.33 12.54,19.58 10.6,17.64 U$2.2
N$5
  Top 0.406: IC2.14 55.55,27.7 54.8,26.95 54.8,14.4 G1.+
N$6
  Top 0.305: U$1.13 20.89,25.13 C10.1
N$7
  Top 0.305: T1.1 7.21,20.83 R23.2
N$8
  Top 0.406: LED1.C R6.1
N$9
  Top 0.406: IC2.1 49.74,32.18 R1.2
N$10
  Top 0.305: U$1.34 12.84,19.08 10.53,16.77 U$2.1
N$11  (via drill 0.4)
  Top 0.305: U$1.15 19.78,23.8 19.16,23.18 v18.88,23.18 v18.87,23.19 | R5.2 14.81,13.88 v14.81,14.33
  Bottom 0.305: v14.81,14.33 14.65,14.33 12.66,16.32 12.66,17.54 17.14,22.02 18.06,22.02 18.87,22.83 v18.87,23.19
N$14  (via drill 0.4)
  Top 0.305: T4.3 36.99,25.91 v36.78,25.7 | 33.24,23.7 33.24,23.67 v33.66,23.25
  Top 0.406: Q5.1 33.24,23.7 R9.2
  Bottom 0.305: v36.78,25.7 36.11,25.7 v33.66,23.25
N$15
  Top 0.305: 37.74,23.36 37.74,23.33 R12.2
  Top 0.406: T4.1 37.74,23.36 | R12.2
N$17
  Top 0.305: IC1.31 32.43,46.06 34.22,47.85 34.22,50.98 U$18.8
N$18
  Top 0.305: IC1.32 32.5,47.06 33.59,48.15 33.59,51.85 33.93,52.19 U$18.7
N$19
  Top 0.305: IC1.33 32.72,48.06 33.03,48.37 33.03,52.8 33.25,53.02 34.52,53.02 U$18.6
N$25
  Top 0.305: U$1.9 24.4,22.08 Y1.P$1 28.16,23.61 C24.1
N$26
  Top 0.305: U$1.8 25.46,21.58 Y1.P$2 27.93,21.11 C23.1
N$27
  Top 0.305: U$6.16 22.45,5.6 23.25,4.8 23.25,2.35 R11.1
N$33
  Top 0.305: R15.1 17.85,1.9 18.85,2.9 18.85,5.6 19.73,6.47 U$6.12
N$45
  Top 0.305: T2.1 6.71,26.46 R18.2 R20.1
N$46
  Top 0.61: IC1.60 J2.P$3
N$48  (via drill 0.4)
  Top 0.305: R21.1 3.35,29.93 2.63,29.93 v2.06,29.36 | T1.3 3.56,22.51 v3.56,22.75
  Top 0.406: C22.2 4.22,32.33 Q4.1 4.35,31.25 4.22,31.12 R21.1
  Bottom 0.305: v3.56,22.75 3.56,27.86 v2.06,29.36
N$49
  Top 0.406: Q4.3 5.04,34.23 C22.1
  Top 0.813: Q4.3 2.15,37.52 2.15,43.51 U$10.1
N$50  (via drill 0.4)
  Top 0.406: 9.11,1.9 U3.4 9.29,1.72 v9.85,1.72 | C32.1 13.29,7.62 v13.11,7.44
  Bottom 0.406: v9.85,1.72 10.32,1.72 11.25,2.65 11.25,5.58 v13.11,7.44
PWRKEY
  Top 0.305: IC1.1 11.75,30.06
  Top 0.406: IC1.1 12,26.6 T2.3
RAW_DIV
  Top 0.305: U$1.3 23.55,19.09 25.71,16.93 27.99,16.92 C18.1
  Top 0.406: R22.2 28.79,13.98 | 28.79,13.98 28.79,15.92 C18.1 | R24.1 28.8,13.97 28.79,13.98
RI
  Top 0.305: U$1.19 17.78,26.72 16.68,27.82 15.62,27.82 15,28.44 IC1.4
RST  (via drill 0.4)
  Top 0.305: U$1.48 20.78,13.03 v20.95,12.86 21.39,12.42 21.39,12.21 21.95,11.65 21.95,11.56 R34.1
  Bottom 0.305: X1.5 5.69,8.51 9.44,12.26 19.47,12.26 20.07,12.86 v20.95,12.86
RTS
  Top 0.305: U$1.17 18.78,29.59 IC1.8
SCL_H  (via drill 0.4)
  Top 0.305: 59.24,48.1 v59.32,48.02 | v61.67,48.28 61.67,48 62.85,46.82 62.85,5.93 61.7,4.78 55.7,4.78 R10.1
  Top 0.406: R10.1 55.33,5.15 v55.33,5.68 | Q2.3 59.24,48.1
  Bottom 0.305: v59.32,48.02 61.38,48.02 61.64,48.28 v61.67,48.28
  Bottom 0.406: v55.33,5.68 58.31,2.7 X5.4
SCL_L  (via drill 0.4)
  Top 0.305: U$1.35 14.86,18.58 v15.23,18.95 | IC2.16 60.47,30.25 61.73,31.51 61.73,35.69 | 61.73,35.69 61.73,43.09 | U$17.6 61.73,35.7 61.73,35.69 | R13.1 61.58,42.94 61.73,43.09 | 61.73,43.09 61.73,45.57 60.75,46.55 56.78,46.55 56.18,47.15 Q2.2
  Top 0.406: IC2.16 53.55,30.25 v51.94,28.63
  Bottom 0.305: v51.94,28.63 51.94,28.51 51.41,27.98 24.93,27.98 15.88,18.93 15.25,18.93 v15.23,18.95
SDA_H  (via drill 0.4)
  Top 0.305: v61.82,3.88 63.42,5.48 63.42,47.66 59.69,51.39 Q3.3 | R2.1 53.51,5.71 54.28,6.48 56.04,6.48 56.98,5.54 v60.01,5.54
  Bottom 0.305: v61.82,3.88 60.01,3.88 | 60.01,3.88 59.77,3.88 59.56,3.67 X5.3 | 60.01,3.88 v60.01,5.54
SDA_L  (via drill 0.4)
  Top 0.305: Q3.2 58.43,50.44 61.73,47.14 | 60.09,29.05 62.29,31.26 62.29,46.58 61.73,47.14 | 60.09,29.05 60.01,28.98 IC2.15 | U$17.5 60.64,33.56 v60.64,33.1 | v60.7,28.56 60.2,29.05 60.09,29.05 | 61.73,47.14 v61.2,47.14 v61.19,47.14 | R16.1 59.34,45.07 v59.92,45.65 | v13.55,17.4 13.73,17.61 U$1.36
  Top 0.406: IC2.15 54.45,28.98 v53.03,27.56
  Bottom 0.305: v53.03,27.56 52.89,27.42 25.15,27.42 15.54,17.81 13.93,17.81 v13.55,17.4 | v60.7,28.56 61.37,29.23 61.37,32.8 61.07,33.1 v60.64,33.1 | v59.92,45.65 61.2,46.92 v61.2,47.14
SIM_VCC
  Top 0.305: 39.73,49.34 37.2,49.34 34.64,46.78 34.64,45.06 | 39.73,49.34 U$3.VCC | 39.73,49.34 39.73,51.52 U$8.3
  Top 0.406: IC1.30 34.64,45.06 C13.2
SIMLOCK_CLK  (via drill 0.4)
  Top 0.305: U$3.CLK 44.73,50.06 42.85,51.94 U$8.4 41.4,51.29 v40.98,51.29 | U$18.2 38.45,52.19 v38.51,52.13
  Bottom 0.305: v40.98,51.29 39.35,51.29 v38.51,52.13
SIMLOCK_IO  (via drill 0.4)
  Top 0.254: U$3.IO 46.25,35.05 46.25,47.29
  Top 0.305: 46.25,47.29 45.7,47.84 45.7,51.21 44.32,52.59 U$8.5 42.02,52.56 v41.36,52.56 | U$18.1 v37.73,51.31 v37.73,51.32 | C14.2 U$3.IO
  Bottom 0.305: v37.73,51.32 38.54,50.51 41.45,50.51 42.27,51.33 42.27,51.65 v41.36,52.56
SIMLOCK_RST  (via drill 0.4)
  Top 0.305: U$18.3 38.75,52.99 39.7,53.94 41.35,53.94 U$8.6 43.15,53.24 43.3,53.39 v44,53.39 | U$3.RST 42.19,50.11 v42.55,50.47
  Bottom 0.305: v44,53.39 44,51.92 v42.55,50.47
STATUS
  Top 0.305: U$1.2 23.26,18.58 24.15,17.69 TP6.TP
  Top 0.406: TP6.TP 24.15,14.22 LED1.A
TEST  (via drill 0.4)
  Top 0.305: U$1.47 20.28,13.95 | 20.28,13.95 20.08,13.76 | 20.08,13.76 R35.1 | 20.08,13.76 | 20.28,13.95 20.16,14.07 v20.06,14.07
  Bottom 0.305: X1.4 6.05,9.76 9.2,12.91 18.77,12.91 19.93,14.07 v20.06,14.07
TS  (via drill 0.4)
  Top 0.305: U$6.1 23.95,5.7 25.85,5.7 28.51,3.04 X4.1 | R14.1 32.21,3.67 v30.9,3.67
  Bottom 0.305: v30.9,3.67 29.34,2.11 X4.1
UART_RX  (via drill 0.4)
  Top 0.305: U$2.5 6.36,19.32 | 6.36,19.32 5.33,19.32 TP2.TP | v6.37,19.6 6.37,19.32 6.36,19.32
  Bottom 0.305: v6.37,19.6 6.83,19.14 6.83,12.82 6.27,12.26 X1.2
UART_TX
  Top 0.305: U$2.6 6.42,18.44 6.13,18.15 4.32,18.15 TP3.TP 4.19,14.5 X1.1
VBAT
  Top 0.813: IC1.56 9,44.86 | 9,44.86 U$10.2 5.3,44.96 5.4,45.06 C26.1 5.4,48.31 C21.1 C20.1 C16.1 | IC1.55 IC1.57 9.2,44.66 9,44.86
VIN
  Top 0.305: 22.45,9.5 U$6.5 22.45,9.71 22.39,9.71
  Top 0.406: U3.1 11.1,3.17 11.15,3.12 | U3.3 9.2,3.2 9.28,3.12
  Top 0.61: 16.64,6.58 16.74,6.58 16.74,8.93 17.52,9.71 22.39,9.71 36.63,9.71 38.6,7.74 45.97,7.74 C6.1 49.64,4.79 | 49.64,4.79 C3.1 | U1.1 49.41,5.02 49.64,4.79
  Top 0.813: C28.1 14.15,4.1 | 14.15,4.1 16.64,6.58 17.27,7.22 U$6.10 | 5.45,30.18 R21.2 | R21.2 6.08,30.24 6.12,30.28 | R21.2 6.09,30.26 6.25,30.42 | 14.15,4.1 13.17,3.12 11.15,3.12 9.28,3.12 8.02,3.12 5.02,6.12 3.96,6.12 2.41,7.67 2.41,27.5 3.42,28.51 4.91,28.51 6.25,29.85 6.25,30.42 | 6.25,30.42 Q4.2
VRAW
  Top 0.61: X6.2 X6.3
  Top 0.813: X6.3 43.25,3.29 40.69,5.85 U$5.1
VRTC
  Top 0.406: IC1.26 34.16,41.06 C12.2

### Text on the board
Top: 1
Bottom: 2
tmine: tp1 | gsm | tp2 | tp3 | Petre Rodan 201510 rev1 | tp4 | github.com/rodan/gprs_i2c_gateway | tp5 | tp6 | tp8 | tp7 | status | debug | ts | 3.7V / bat | 5V | i2c